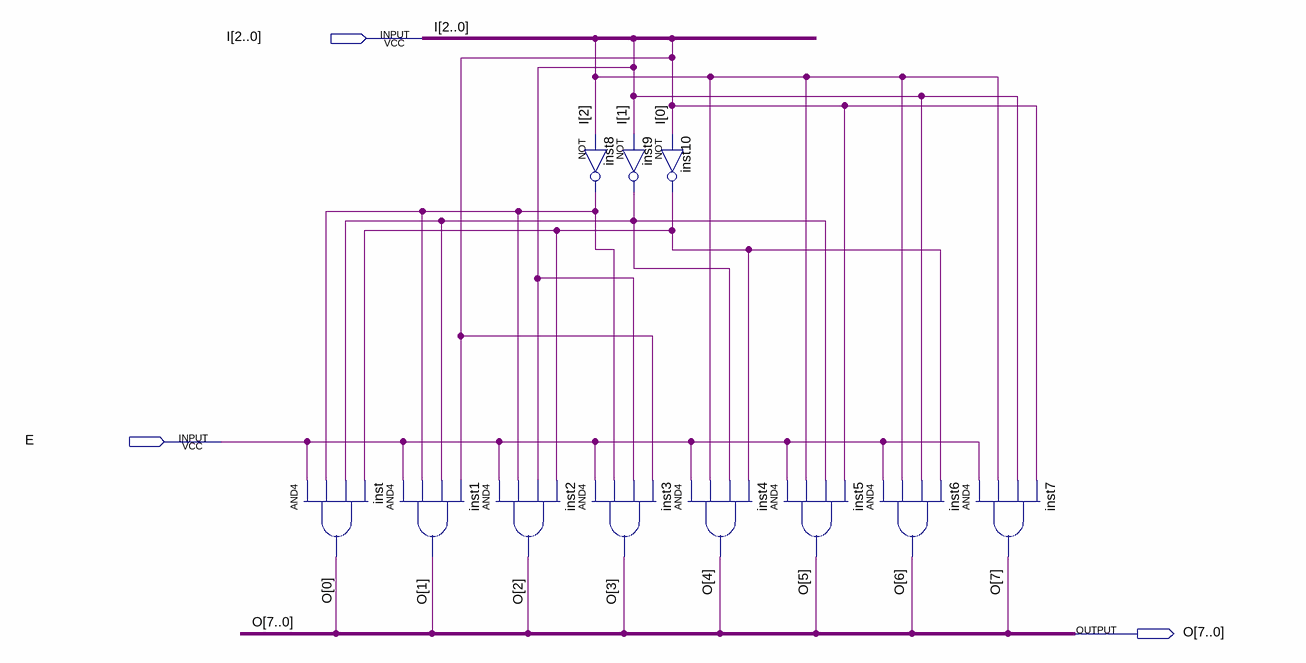
[diagram p0: schematic sheet]
// Quartus schematic Decoder.bdf as structural Verilog: 11 symbols, 3 pins
module Decoder (
  input  [2:0] I,
  input  E,
  output [7:0] O
);

  wire inst8_out, inst9_out, inst10_out;

  and inst (O[0], E, inst8_out, inst9_out, inst10_out);
  and inst1 (O[1], E, inst8_out, inst9_out, I[0]);
  and inst2 (O[2], E, inst8_out, I[1], inst10_out);
  not inst8 (inst8_out, I[2]);
  and inst3 (O[3], E, inst8_out, I[1], I[0]);
  not inst9 (inst9_out, I[1]);
  not inst10 (inst10_out, I[0]);
  and inst4 (O[4], E, I[2], inst9_out, inst10_out);
  and inst5 (O[5], E, I[2], inst9_out, I[0]);
  and inst6 (O[6], E, I[2], I[1], inst10_out);
  and inst7 (O[7], E, I[2], I[1], I[0]);
endmodule
